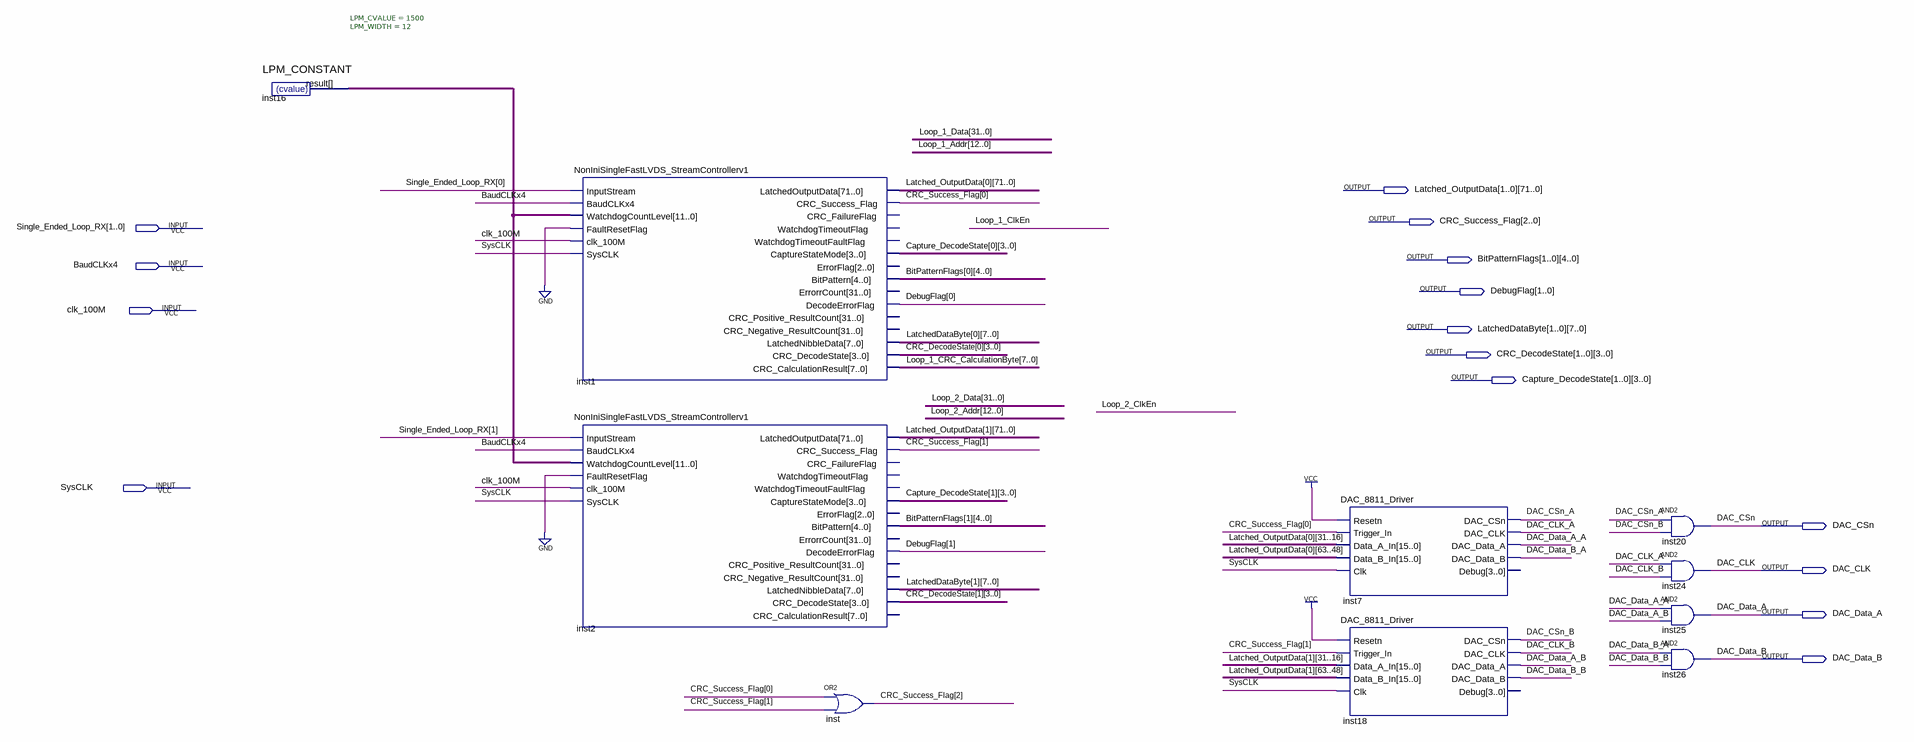
[diagram p0: schematic sheet]
// Quartus schematic DualFast4B5BChannels.bdf as structural Verilog: 10 symbols, 15 pins
module DualFast4B5BChannels (
  input  [1:0] Single_Ended_Loop_RX,
  input  BaudCLKx4,
  input  clk_100M,
  input  SysCLK,
  output [71:0] Latched_OutputData_1,
  output [71:0] Latched_OutputData_0,
  output [2:0] CRC_Success_Flag,
  output [4:0] BitPatternFlags_1,
  output [4:0] BitPatternFlags_0,
  output [1:0] DebugFlag,
  output [7:0] LatchedDataByte_1,
  output [7:0] LatchedDataByte_0,
  output [3:0] CRC_DecodeState_1,
  output [3:0] CRC_DecodeState_0,
  output [3:0] Capture_DecodeState_1,
  output [3:0] Capture_DecodeState_0,
  output DAC_CSn,
  output DAC_CLK,
  output DAC_Data_A,
  output DAC_Data_B
);

  wire DAC_CLK_A, DAC_CLK_B, DAC_CSn_A, DAC_CSn_B, DAC_Data_A_A, DAC_Data_A_B, DAC_Data_B_A, DAC_Data_B_B;
  wire [7:0] Loop_1_CRC_CalculationByte;
  wire [11:0] inst16_result;

  LPM_CONSTANT #(.LPM_CVALUE(1500), .LPM_WIDTH(12)) inst16 (.result(inst16_result));
  NonIniSingleFastLVDS_StreamControllerv1 inst1 (
    .InputStream(Single_Ended_Loop_RX[0]), .BaudCLKx4(BaudCLKx4), .WatchdogCountLevel(inst16_result),
    .FaultResetFlag(1'b0), .clk_100M(clk_100M), .SysCLK(SysCLK), .LatchedOutputData(Latched_OutputData_0),
    .CRC_Success_Flag(CRC_Success_Flag[0]), .CaptureStateMode(Capture_DecodeState_0),
    .BitPattern(BitPatternFlags_0), .DecodeErrorFlag(DebugFlag[0]), .LatchedNibbleData(LatchedDataByte_0),
    .CRC_DecodeState(CRC_DecodeState_0), .CRC_CalculationResult(Loop_1_CRC_CalculationByte));  // open: CRC_FailureFlag, WatchdogTimeoutFlag, WatchdogTimeoutFaultFlag, ErrorFlag, ErrorrCount, CRC_Positive_ResultCount, CRC_Negative_ResultCount
  NonIniSingleFastLVDS_StreamControllerv1 inst2 (
    .InputStream(Single_Ended_Loop_RX[1]), .BaudCLKx4(BaudCLKx4), .WatchdogCountLevel(inst16_result),
    .FaultResetFlag(1'b0), .clk_100M(clk_100M), .SysCLK(SysCLK), .LatchedOutputData(Latched_OutputData_1),
    .CRC_Success_Flag(CRC_Success_Flag[1]), .CaptureStateMode(Capture_DecodeState_1),
    .BitPattern(BitPatternFlags_1), .DecodeErrorFlag(DebugFlag[1]), .LatchedNibbleData(LatchedDataByte_1),
    .CRC_DecodeState(CRC_DecodeState_1));  // open: CRC_FailureFlag, WatchdogTimeoutFlag, WatchdogTimeoutFaultFlag, ErrorFlag, ErrorrCount, CRC_Positive_ResultCount, CRC_Negative_ResultCount, CRC_CalculationResult
  or inst (CRC_Success_Flag[2], CRC_Success_Flag[0], CRC_Success_Flag[1]);
  DAC_8811_Driver inst7 (
    .Resetn(1'b1), .Trigger_In(CRC_Success_Flag[0]), .Data_A_In(Latched_OutputData_0[31:16]),
    .Data_B_In(Latched_OutputData_0[63:48]), .Clk(SysCLK), .DAC_CSn(DAC_CSn_A), .DAC_CLK(DAC_CLK_A),
    .DAC_Data_A(DAC_Data_A_A), .DAC_Data_B(DAC_Data_B_A));  // open: Debug
  DAC_8811_Driver inst18 (
    .Resetn(1'b1), .Trigger_In(CRC_Success_Flag[1]), .Data_A_In(Latched_OutputData_1[31:16]),
    .Data_B_In(Latched_OutputData_1[63:48]), .Clk(SysCLK), .DAC_CSn(DAC_CSn_B), .DAC_CLK(DAC_CLK_B),
    .DAC_Data_A(DAC_Data_A_B), .DAC_Data_B(DAC_Data_B_B));  // open: Debug
  and inst20 (DAC_CSn, DAC_CSn_A, DAC_CSn_B);
  and inst24 (DAC_CLK, DAC_CLK_A, DAC_CLK_B);
  and inst25 (DAC_Data_A, DAC_Data_A_A, DAC_Data_A_B);
  and inst26 (DAC_Data_B, DAC_Data_B_A, DAC_Data_B_B);
endmodule
